# EAGLE schematic AD7771Breakout_HigherEnd (EAGLE 9.5.1)
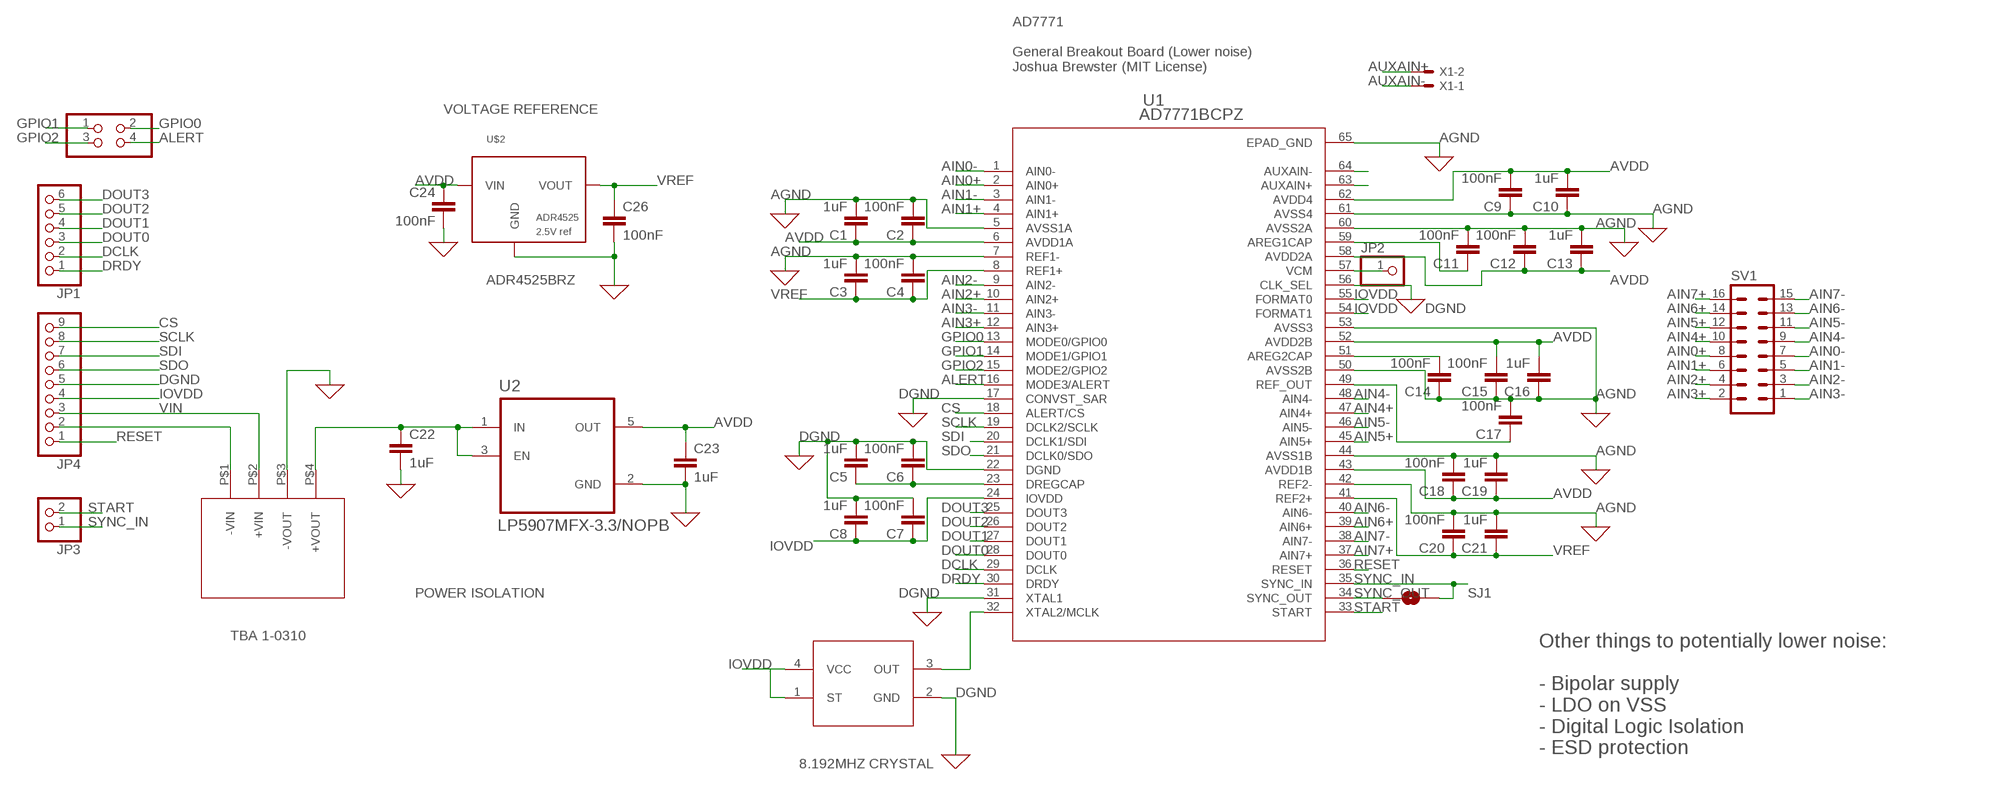
[diagram p0: schematic, sheet 1]

## Parts
C1  1uF  C-EUC0402  [C0402]
C2  100nF  C-EUC0402  [C0402]
C3  1uF  C-EUC0402  [C0402]
C4  100nF  C-EUC0402  [C0402]
C5  1uF  C-EUC0402  [C0402]
C6  100nF  C-EUC0402  [C0402]
C7  100nF  C-EUC0402  [C0402]
C8  1uF  C-EUC0402  [C0402]
C9  100nF  C-EUC0402  [C0402]
C10  1uF  C-EUC0402  [C0402]
C11  100nF  C-EUC0402  [C0402]
C12  100nF  C-EUC0402  [C0402]
C13  1uF  C-EUC0402  [C0402]
C14  100nF  C-EUC0402  [C0402]
C15  100nF  C-EUC0402  [C0402]
C16  1uF  C-EUC0402  [C0402]
C17  100nF  C-EUC0402  [C0402]
C18  100nF  C-EUC0402  [C0402]
C19  1uF  C-EUC0402  [C0402]
C20  100nF  C-EUC0402  [C0402]
C21  1uF  C-EUC0402  [C0402]
C22  1uF  C-EUC0402  [C0402]
C23  1uF  C-EUC0402  [C0402]
C24  100nF  C-EUC0402  [C0402]
C26  100nF  C-EUC0402  [C0402]
JP1  PINHD-1X6  [1X06]
JP2  PINHD-1X1  [1X01]
JP3  PINHD-1X2  [1X02]
JP4  PINHD-1X9  [1X09]
JP5  PINHD-2X2  [2X02]
SJ1  SOLDERJUMPERNC  [SJ_2S_SMALL]
SV1  MA08-2  [MA08-2]
U1  AD7771BCPZ  [CP_64_15_ADI]
U2  LP5907MFX-3.3/NOPB  [SOT95P280X145-5N]
U$1  TBA1-0310  [SIP4-KT]
U$2  ADR4525  [SOIC-8]
U$3  SG-210STF8.1920ML3  [XTAL_FA-238_25.0000MB-C3]
X1  332-02  [332-02]

## Nets
AGND: C1.2 C2.2 C3.2 C4.2 C9.1 C10.1 C11.2 C12.2 C13.2 C14.1 C15.1 C16.1 C17.2 C18.2 C19.2 C20.2 C21.2 C22.2 C23.2 C24.2 C26.2 U1.5(AVSS1A) U1.7(REF1-) U1.42(REF2-) U1.44(AVSS1B) U1.50(AVSS2B) U1.53(AVSS3) U1.60(AVSS2A) U1.61(AVSS4) U1.65(EPAD_GND) U2.2(GND) U$1.P$3(-VOUT) U$2.4(GND) ; supply symbol labelled GND
AIN0+: SV1.8 U1.2(AIN0+)
AIN0-: SV1.7 U1.1(AIN0-)
AIN1+: SV1.6 U1.4(AIN1+)
AIN1-: SV1.5 U1.3(AIN1-)
AIN2+: SV1.4 U1.10(AIN2+)
AIN2-: SV1.3 U1.9(AIN2-)
AIN3+: SV1.2 U1.12(AIN3+)
AIN3-: SV1.1 U1.11(AIN3-)
AIN4+: SV1.10 U1.47(AIN4+)
AIN4-: SV1.9 U1.48(AIN4-)
AIN5+: SV1.12 U1.45(AIN5+)
AIN5-: SV1.11 U1.46(AIN5-)
AIN6+: SV1.14 U1.39(AIN6+)
AIN6-: SV1.13 U1.40(AIN6-)
AIN7+: SV1.16 U1.37(AIN7+)
AIN7-: SV1.15 U1.38(AIN7-)
ALERT: JP5.4 U1.16(MODE3/ALERT)
AUXAIN+: U1.63(AUXAIN+) X1.2
AUXAIN-: U1.64(AUXAIN-) X1.1
AVDD: C1.1 C2.1 C9.2 C10.2 C12.1 C13.1 C15.2 C16.2 C18.1 C19.1 C23.1 C24.1 U1.6(AVDD1A) U1.43(AVDD1B) U1.52(AVDD2B) U1.58(AVDD2A) U1.62(AVDD4) U2.5(OUT) U$2.2(VIN)
CS: JP4.9 U1.18(ALERT/CS)
DCLK: JP1.2 U1.29(DCLK)
DGND: C5.2 C6.2 C7.2 C8.2 JP4.5 U1.17(CONVST_SAR) U1.22(DGND) U1.31(XTAL1) U1.56(CLK_SEL) U$3.2(GND) ; supply symbol labelled GND
DOUT0: JP1.3 U1.28(DOUT0)
DOUT1: JP1.4 U1.27(DOUT1)
DOUT2: JP1.5 U1.26(DOUT2)
DOUT3: JP1.6 U1.25(DOUT3)
DRDY: JP1.1 U1.30(DRDY)
GND: JP4.2 U$1.P$1(-VIN)
GPIO0: JP5.2 U1.13(MODE0/GPIO0)
GPIO1: JP5.1 U1.14(MODE1/GPIO1)
GPIO2: JP5.3 U1.15(MODE2/GPIO2)
IOVDD: C7.1 C8.1 JP4.4 U1.24(IOVDD) U1.54(FORMAT1) U1.55(FORMAT0) U$3.1(ST) U$3.4(VCC)
N$2: U1.32(XTAL2/MCLK) U$3.3(OUT)
N$3: C22.1 U2.1(IN) U2.3(EN) U$1.P$4(+VOUT)
N$9: C5.1 C6.1 U1.23(DREGCAP)
N$11: JP2.1 U1.57(VCM)
N$13: C11.1 U1.59(AREG1CAP)
N$15: C14.2 U1.51(AREG2CAP)
N$18: C17.1 U1.49(REF_OUT)
RESET: JP4.1 U1.36(RESET)
SCLK: JP4.8 U1.19(DCLK2/SCLK)
SDI: JP4.7 U1.20(DCLK1/SDI)
SDO: JP4.6 U1.21(DCLK0/SDO)
START: JP3.2 U1.33(START)
SYNC_IN: JP3.1 SJ1.2 U1.35(SYNC_IN)
SYNC_OUT: SJ1.1 U1.34(SYNC_OUT)
VIN: JP4.3 U$1.P$2(+VIN)
VREF: C3.1 C4.1 C20.1 C21.1 C26.1 U1.8(REF1+) U1.41(REF2+) U$2.6(VOUT)

## Notes on the sheet
- AD7771
  
  General Breakout Board (Lower noise)
  Joshua Brewster (MIT License)
- VOLTAGE REFERENCE
- ADR4525BRZ
- POWER ISOLATION
- TBA 1-0310
- Other things to potentially lower noise:
  
  - Bipolar supply
  - LDO on VSS
  - Digital Logic Isolation
  - ESD protection
- 8.192MHZ CRYSTAL

## Library data of the parts
C1-C24 C26 = rcl:C-EU: CAPACITOR, European symbol; SPICEPREFIX: C
JP1 = pinhead:PINHD-1X6: PIN HEADER
JP2 = pinhead:PINHD-1X1: PIN HEADER
JP3 = pinhead:PINHD-1X2: PIN HEADER
JP4 = pinhead:PINHD-1X9: PIN HEADER
JP5 = pinhead:PINHD-2X2: PIN HEADER
SJ1 = headers:SOLDERJUMPER: Solder Jumper Standard SMD solder jumper. Used to automate production. Two varients : Normally Open and Normally Closed are the same, but have different paste layers. NC will have a large amount of paste and should jumper during reflow.
SV1 = con-lstb:MA08-2: PIN HEADER; OC_FARNELL: unknown; OC_NEWARK: unknown
U1 = AD7771:AD7771BCPZ; BUILT_BY: Analog Devices Inc.; MANUFACTURER_PART_NUMBER: AD7771BCPZ; SOURCELIBRARY: Analog_2017-10-24; VENDOR: Analog Devices Inc
U2 = LP5907MFX-3.3_NOPB:LP5907MFX-3.3/NOPB: IC REG LINEAR 3.3V 250MA SOT23; AVAILABILITY: Unavailable; DESCRIPTION: Linear Voltage Regulator IC 1 Output 250mA SOT-23-5; MF: Texas Instruments; MP: LP5907MFX-3.3/NOPB; PACKAGE: SOT-23 Texas Instruments; PRICE: None
U$1 = TBA1-0310:TBA1-0310
U$2 = ADR4525 (1):ADR4525; AVAILABILITY: Unavailable; DESCRIPTION: Series Voltage Reference IC ±0.02% 8-SOIC; MF: Analog Devices; MP: ADR4525; PACKAGE: SOIC-8 Analog Devices; PRICE: None
U$3 = XTAL_FA-238_25.0000MB-C3:SG-210STF8.1920ML3
X1 = con-garry:332-02: 2 Pin - 2mm Dual Row Source: www.mpe-connector.de / garry_shortform_2012.pdf